# Altium schematic sheet COMMUNICATION.SchDoc
size 420 x 297 mm; SheetNumber: 4; SheetTotal: 5
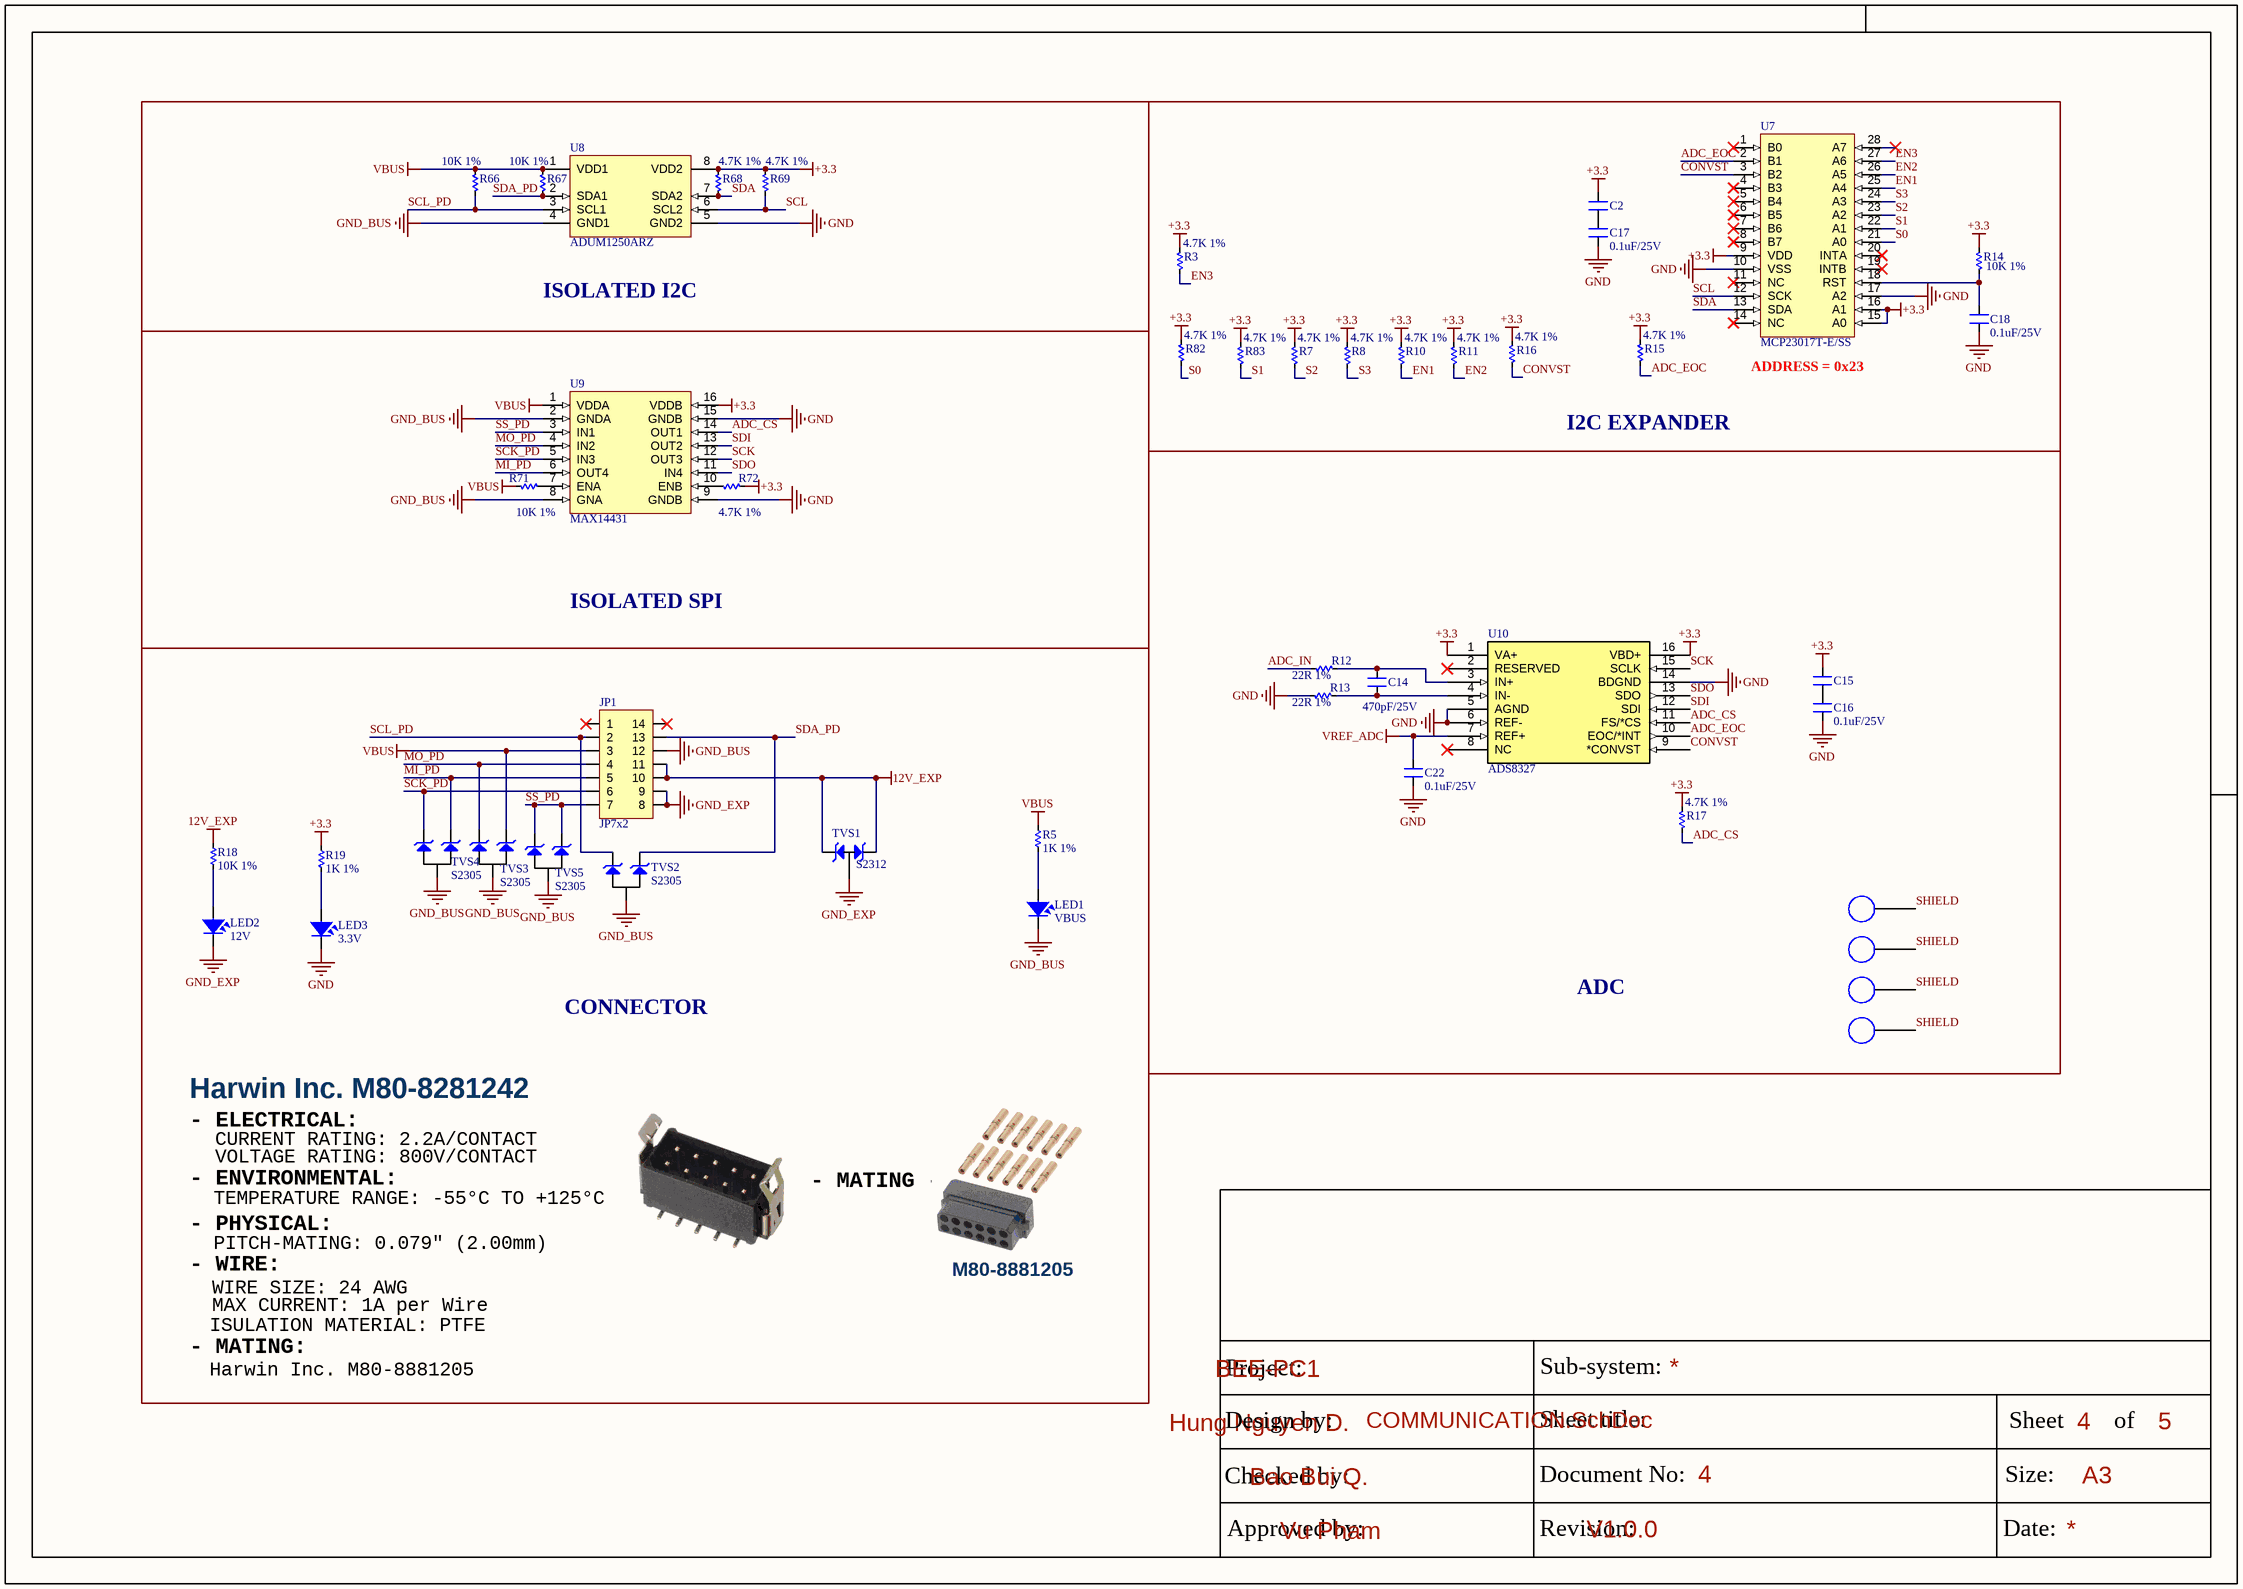
[diagram p0: COMMUNICATION.SchDoc]

## Parts
C2  0.1uF/25V  [SM-0603]  (value not drawn)
C14  470pF/25V  [SM-0603]
C15  0.1uF/25V  [SM-0603]  (value not drawn)
C16  0.1uF/25V  [SM-0603]
C17  0.1uF/25V  [SM-0603]
C18  0.1uF/25V  [SM-0603]
C22  0.1uF/25V  [SM-0603]
H1  M3  [M3]  (value not drawn)
H2  M3  [M3]  (value not drawn)
H3  M3  [M3]  (value not drawn)
H4  M3  [M3]  (value not drawn)
JP1  JP7x2  [M80-8281442]
LED1  VBUS  [GREENLED_0603]
LED2  12V  [GREENLED_0603]
LED3  3.3V  [GREENLED_0603]
R3  4.7K 1%  [RES-SMD-0603]
R5  1K 1%  [RES-SMD-0603]
R7  4.7K 1%  [RES-SMD-0603]
R8  4.7K 1%  [RES-SMD-0603]
R10  4.7K 1%  [RES-SMD-0603]
R11  4.7K 1%  [RES-SMD-0603]
R12  22R 1%  [RES-SMD-0603]
R13  22R 1%  [RES-SMD-0603]
R14  10K 1%  [RES-SMD-0603]
R15  4.7K 1%  [RES-SMD-0603]
R16  4.7K 1%  [RES-SMD-0603]
R17  4.7K 1%  [RES-SMD-0603]
R18  10K 1%  [RES-SMD-0603]
R19  1K 1%  [RES-SMD-0603]
R66  10K 1%  [RES-SMD-0603]
R67  10K 1%  [RES-SMD-0603]
R68  4.7K 1%  [RES-SMD-0603]
R69  4.7K 1%  [RES-SMD-0603]
R71  10K 1%  [RES-SMD-0603]
R72  4.7K 1%  [RES-SMD-0603]
R82  4.7K 1%  [RES-SMD-0603]
R83  4.7K 1%  [RES-SMD-0603]
TVS1  S2312  [SOT23-123]
TVS2  S2305  [SOT23-123]
TVS3  S2305  [SOT23-123]
TVS4  S2305  [SOT23-123]
TVS5  S2305  [SOT23-123]
U7  MCP23017T-E/SS  [SSOP28]
U8  ADUM1250ARZ  [SO8]
U9  MAX14431  [MAX14431]
U10  ADS8327  [TSSOP16]

## Blocks framed on the sheet
ISOLATED I2C: R66-R69 U8
I2C EXPANDER: C2 C17 C18 R3 R7 R8 R10 R11 R14-R16 R82 R83 U7
ISOLATED SPI: R71 R72 U9
ADC: C14-C16 C22 H1-H4 R12 R13 R17 U10
Harwin Inc. M80-8281242: JP1 LED1-LED3 R5 R18 R19 TVS1-TVS5

## Nets
12V_EXP: JP1.10 JP1.11 R18.2 TVS1.1 TVS1.3
+3.3: C2.2 C15.2 R3.2 R7.2 R8.2 R10.2 R11.2 R14.2 R15.2 R16.2 R17.2 R19.2 R68.2 R69.2 R72.1 R82.2 R83.2 U7.9(VDD) U7.15(A0) U7.16(A1) U8.8(VDD2) U9.16(VDDB) U10.1(VA+) U10.16(VBD+)
GND: C16.1 C17.1 C18.1 C22.1 LED3.2 R13.2 U7.10(VSS) U7.17(A2) U8.5(GND2) U9.9(GNDB) U9.15(GNDB) U10.5(AGND) U10.6(REF-) U10.14(BDGND)
GND_BUS: JP1.12 LED1.2 TVS2.2 TVS3.2 TVS4.2 TVS5.2 U8.4(GND1) U9.2(GNDA) U9.8(GNA)
GND_EXP: JP1.8 JP1.9 LED2.2 TVS1.2
VBUS: JP1.3 R5.2 R66.2 R67.2 R71.2 TVS3.3 U8.1(VDD1) U9.1(VDDA)
VREF_ADC: C22.2 U10.7(REF+)
ADC_CS: R17.1 U9.14(OUT1) U10.11(FS/*CS)
ADC_EOC: R15.1 U7.2(B1) U10.10(EOC/*INT)
ADC_IN: R12.2
CONVST: R16.1 U7.3(B2) U10.9(*CONVST)
EN1: R10.1 U7.25(A4)
EN2: R11.1 U7.26(A5)
EN3: R3.1 U7.27(A6)
MI_PD: JP1.5 TVS4.3 U9.6(OUT4)
MO_PD: JP1.4 TVS3.1 U9.4(IN2)
S0: R82.1 U7.21(A0)
S1: R83.1 U7.22(A1)
S2: R7.1 U7.23(A2)
S3: R8.1 U7.24(A3)
SCK: U9.12(OUT3) U10.15(SCLK)
SCK_PD: JP1.6 TVS4.1 U9.5(IN3)
SCL: R69.1 U7.12(SCK) U8.6(SCL2)
SCL_PD: JP1.2 R66.1 TVS2.1 U8.3(SCL1)
SDA: R68.1 U7.13(SDA) U8.7(SDA2)
SDA_PD: JP1.13 R67.1 TVS2.3 U8.2(SDA1)
SDI: U9.13(OUT2) U10.12(SDI)
SDO: U9.11(IN4) U10.13(SDO)
SHIELD: H1.1 H2.1 H3.1 H4.1
SS_PD: JP1.7 TVS5.1 TVS5.3 U9.3(IN1)
NetC2_1: C2.1 C17.2
NetC14_1: C14.1 R13.1 U10.4(IN-)
NetC14_2: C14.2 R12.1 U10.3(IN+)
NetC15_1: C15.1 C16.2
NetC18_2: C18.2 R14.1 U7.18(RST)
NetLED1_1: LED1.1 R5.1
NetLED2_1: LED2.1 R18.1
NetLED3_1: LED3.1 R19.1
NetR71_1: R71.1 U9.7(ENA)
NetR72_2: R72.2 U9.10(ENB)

Not connected (* = marked no-connect by the designer): JP1 1* 14*; U7 1(B0)* 4(B3)* 5(B4)* 6(B5)* 7(B6)* 8(B7)* 11(NC)* 14(NC)* 19(INTB)* 20(INTA)* 28(A7)*; U10 2(RESERVED)* 8(NC)*

## Notes on the sheet
- (near U7) ADDRESS = 0x23
- CONNECTOR
- - ELECTRICAL:
- - ENVIRONMENTAL:
- TEMPERATURE RANGE: -55°C TO +125°C
- CURRENT RATING: 2.2A/CONTACT
- VOLTAGE RATING: 800V/CONTACT
- - MATING -
- - PHYSICAL:
- - WIRE:
- PITCH-MATING: 0.079" (2.00mm)
- ISULATION MATERIAL: PTFE
- WIRE SIZE: 24 AWG
- MAX CURRENT: 1A per Wire
- M80-8881205
- - MATING:
- Harwin Inc. M80-8881205
- Project:
- BEE-PC1
- Sub-system:
- Design by:
- Hung Nguyen D.
- Bao Bui Q.
- Sheet title:
- Sheet
- A3
- of
- Checked by:
- Approved by:
- Vu Pham
- Revision:
- Document No:
- V1.0.0
- Size:
- Date:

## Library data of the parts
C2 C14-C18 C22 = CM: 0603; Value: 103
JP1 = JP7x2: WR-PHD 2.54 mm Dual Socket Header; Manufacturer: W¨¹rth Elektronik eiSos GmbH; partNo: 61301421821; ComponentLink1 Description: Manufacturer; ComponentLink2 Description: Datasheet; NoPins: 14; Created Date: 29 March 2013; ComponentLink1URL: http://www.we-online.com; ComponentLink2URL: http://katalog.we-online.de/em/datasheet/6130xx21821.pdf; Created by: Karrer Zheng
LED1-LED3 = LED SMD: Value: LED 3 - 5 ly 2 Colour
R3 R5 R7 R8 R10-R19 R66-R69 R71 R72 R82 R83 = Res-SMD: 0603; Manufacturer: Generic Components; Class: Passive; Published: 08/06/2000; Publisher: Altium Hobart Technology Centre
TVS1 = S2315: TVS DIODE 12VWM 19VC SOT23, P/N:  S2312
TVS2-TVS5 = S2303: TVS DIODE 5VWM 10.8VC SOT23, P/N: / S2305
U7 = MCP23017
U8 = ADUM1250
U9 = MAX14431: MAX14431CAEE+
U10 = ADS8327: IC ADC 16BIT SAR 16TSSOP; Supplier 1: Mouser; Supplier Part Number 1: 595-ADS8327IPW